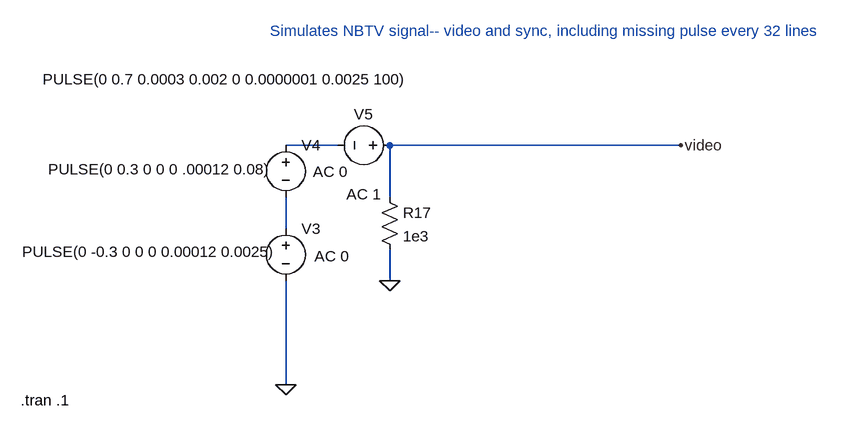
[diagram p0: schematic vidsrc.asc]
vidsrc.asc, the LTspice schematic file:
Version 4
SHEET 1 1280 2132
WIRE -1264 160 -1344 160
WIRE -736 160 -1184 160
WIRE -1184 240 -1184 160
WIRE -1344 288 -1344 240
WIRE -1184 368 -1184 320
WIRE -1344 528 -1344 368
FLAG -1344 528 0
FLAG -1184 368 0
FLAG -736 160 video
SYMBOL voltage -1344 272 R0
WINDOW 123 44 59 Left 0
WINDOW 39 0 0 Left 0
WINDOW 3 -406 52 Left 0
SYMATTR Value2 AC 0
SYMATTR Value PULSE(0 -0.3 0 0 0 0.00012 0.0025)
SYMATTR InstName V3
SYMBOL voltage -1344 144 R0
WINDOW 3 -366 53 Left 0
WINDOW 123 42 57 Left 0
WINDOW 39 0 0 Left 0
SYMATTR Value PULSE(0 0.3 0 0 0 .00012 0.08)
SYMATTR Value2 AC 0
SYMATTR InstName V4
SYMBOL voltage -1168 160 R90
WINDOW 0 -32 56 VBottom 0
WINDOW 3 -117 267 VTop 0
WINDOW 123 60 56 VTop 0
WINDOW 39 0 0 Left 0
SYMATTR InstName V5
SYMATTR Value PULSE(0 0.7 0.0003 0.002 0 0.0000001 0.0025 100)
SYMATTR Value2 AC 1
SYMBOL res -1200 224 R0
SYMATTR InstName R17
SYMATTR Value 1e3
TEXT -1368 -16 Left 0 ;Simulates NBTV signal-- video and sync, including missing pulse every 32 lines
TEXT -1752 552 Left 0 !.tran .1

The netlist it stands for:
* vidsrc.asc
V3 N002 0 PULSE(0 -0.3 0 0 0 0.00012 0.0025) AC 0
V4 N001 N002 PULSE(0 0.3 0 0 0 .00012 0.08) AC 0
V5 video N001 PULSE(0 0.7 0.0003 0.002 0 0.0000001 0.0025 100) AC 1
R17 video 0 1e3
* Simulates NBTV signal-- video and sync, including missing pulse every 32 lines
.tran .1
.backanno
.end